# Altium project Level Switching Isolator.PrjPcb
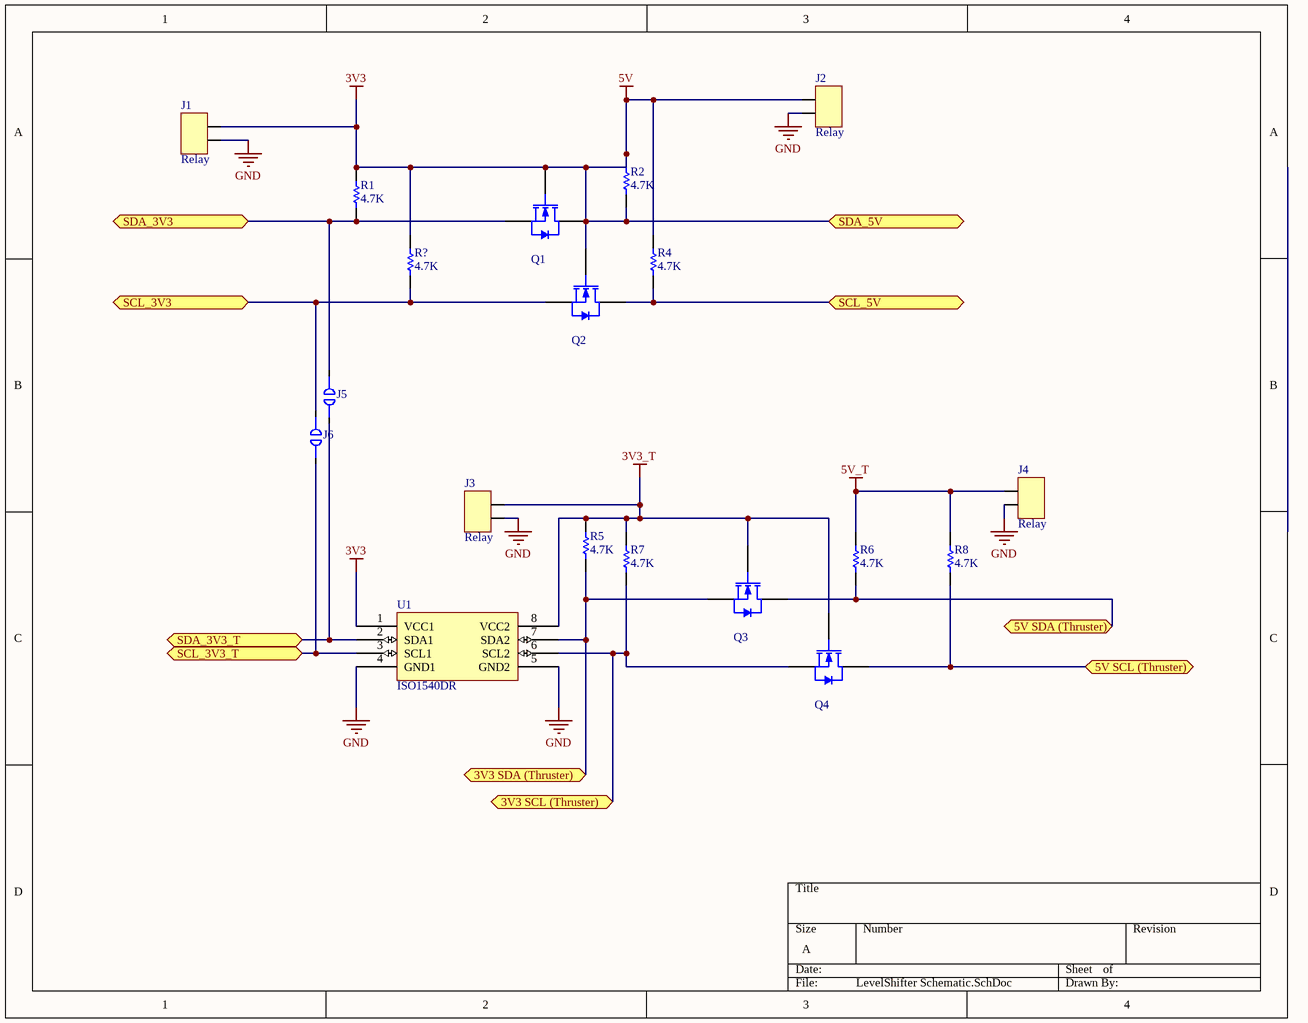
[diagram p0: LevelShifter Schematic.SchDoc]
1 sheet, 19 parts. Net scope: flat (ports and power ports of the same name join across sheets).

## Sheet LevelShifter Schematic.SchDoc
size A; SheetNumber: 1; SheetTotal: 1

### Parts
J1  Relay  [2PinHeader]
J2  Relay  [2PinHeader]
J3  Relay  [2PinHeader]
J4  Relay  [2PinHeader]
J5  Solder Jumper  [SolderJumper]  (value not drawn)
J6  Solder Jumper  [SolderJumper]  (value not drawn)
Q1  MOSFET N-CH  [ONSC-SOT-23-3-318-08_V]  (value not drawn)
Q2  MOSFET N-CH  [ONSC-SOT-23-3-318-08_V]  (value not drawn)
Q3  MOSFET N-CH  [ONSC-SOT-23-3-318-08_V]  (value not drawn)
Q4  MOSFET N-CH  [ONSC-SOT-23-3-318-08_V]  (value not drawn)
R1  4.7K  [RESC1609X55X30NL10T20]
R2  4.7K  [RESC1609X55X30NL10T20]
R4  4.7K  [RESC1609X55X30NL10T20]
R5  4.7K  [RESC1609X55X30NL10T20]
R6  4.7K  [RESC1609X55X30NL10T20]
R7  4.7K  [RESC1609X55X30NL10T20]
R8  4.7K  [RESC1609X55X30NL10T20]
R?  4.7K  [RESC1609X55X30NL10T20]
U1  ISO1540DR

### Ports
3V3 SCL (Thruster) (bidir), 3V3 SDA (Thruster) (bidir), 5V SCL (Thruster) (bidir), 5V SDA (Thruster) (bidir), SCL_3V3 (bidir), SCL_3V3_T (bidir), SCL_5V (bidir), SDA_3V3 (bidir), SDA_3V3_T (bidir), SDA_5V (bidir)

### Nets
3V3: J1.2 J2.1 Q1.1(G) Q1.3(D) Q2.1(G) R1.2 R2.1 R2.2 R4.2 R?.2 U1.1(VCC1) ; port SDA_5V  [also labelled 5V]
3V3_T: J3.2 Q3.1(G) Q4.1(G) R5.2 R7.2 U1.8(VCC2)
5V_T: J4.1 R6.2 R8.2
GND: J1.1 J2.2 J3.1 J4.2 U1.4(GND1) U1.5(GND2)
NetJ5_1: J5.1 U1.2(SDA1) ; port SDA_3V3_T
NetJ5_2: J5.2 Q1.2(S) R1.1 ; port SDA_3V3
NetJ6_1: J6.1 U1.3(SCL1) ; port SCL_3V3_T
NetJ6_2: J6.2 Q2.2(S) R?.1 ; port SCL_3V3
NetQ2_3: Q2.3(D) R4.1 ; port SCL_5V
NetQ3_2: Q3.2(S) R5.1 U1.7(SDA2) ; port 3V3 SDA (Thruster)
NetQ3_3: Q3.3(D) R6.1 ; port 5V SDA (Thruster)
NetQ4_2: Q4.2(S) R7.1 U1.6(SCL2) ; port 3V3 SCL (Thruster)
NetQ4_3: Q4.3(D) R8.1 ; port 5V SCL (Thruster)

### Library data of the parts
J1-J4 = 2PinHeader: Supplier 1: Digi-Key; Supplier Part Number 1: 3M9457-36-ND
J5 J6 = Solder Jumper: Simple Jumper
Q1-Q4 = BSS138LT1G: MOSFET N-CH 50V 200MA SOT-23; Manufacturer 1: ON Semiconductor; Rds On Max: 3.5R; Max Power Dissipation: 225mW; Input Capacitance: 50pF; Turn-Off Delay Time: 20ns; Gate to Source Voltage (Vgs): 20V; Number of Elements: 1; Element Configuration: Single; Threshold Voltage: 1.5V; Supplier 1: Digi-Key; Supplier Part Number 1: BSS138LT1GOSCT-ND; Manufacturer Part Number 1: BSS138LT1G; Stock 1: 952638; Pricing 1: 1=0.26000, 10=0.21100, 100=0.11210, 500=0.07376, 1000=0.05016 (USD); RoHS: Yes; Case/Package: SOT-23-3; Number of Pins: 3; Contact Plating: Tin,Matte; Min Operating Temperature: -55°C; Max Operating Temperature: 150°C; Packaging: Tape and Reel; Continuous Drain Current (ID): 200mA; Drain to Source Resistance: 3.5R; Package Quantity: 1; Drain to Source Breakdown Voltage: 50V; Power Dissipation: 225mW; Turn-On Delay Time: 20ns; Nominal Vgs: 1.5V; Voltage Rating (DC): 50V; Current Rating: 200mA; On-State Resistance: 3.5R; Length: 3.04mm; Height: 1.01mm; Width: 1.4mm; Radiation Hardening: No; Lead Free: Lead Free; REACH SVHC: No SVHC; Halogen Free: Halogen Free; ComponentLink1URL: https://datasheet.ciiva.com/22641/1596366-22641636.pdf?src-supplier=Element14; ComponentLink1Description: https://datasheet.ciiva.com/22641/1596366-22641636.pdf?src-supplier=Element14; ComponentLink2URL: https://datasheet.ciiva.com/936/bss138lt1-d-936801.pdf?src-supplier=Digi-Key; ComponentLink2Description: https://datasheet.ciiva.com/936/bss138lt1-d-936801.pdf?src-supplier=Digi-Key; ComponentLink3URL: https://datasheet.ciiva.com/936/bss138lt1-d-936802.pdf?src-supplier=Digi-Key; ComponentLink3Description: https://datasheet.ciiva.com/936/bss138lt1-d-936802.pdf?src-supplier=Digi-Key; ComponentLink4URL: https://datasheet.ciiva.com/936/bss138lt1-d-936803.pdf?src-supplier=Digi-Key; ComponentLink4Description: https://datasheet.ciiva.com/936/bss138lt1-d-936803.pdf?src-supplier=Digi-Key; ComponentLink5URL: https://datasheet.ciiva.com/14553/70099493-14553829.pdf?src-supplier=Allied+Electronics; ComponentLink5Description: https://datasheet.ciiva.com/14553/70099493-14553829.pdf?src-supplier=Allied+Electronics; ComponentLink6URL: https://datasheet.ciiva.com/1190/1596366-1190136.pdf?src-supplier=Element14; ComponentLink6Description: https://datasheet.ciiva.com/1190/1596366-1190136.pdf?src-supplier=Element14; ComponentLink7URL: https://datasheet.ciiva.com/1190/1596366-1190137.pdf?src-supplier=Element14; ComponentLink7Description: https://datasheet.ciiva.com/1190/1596366-1190137.pdf?src-supplier=Element14; ComponentLink8URL: https://datasheet.ciiva.com/15198/getdatasheetpartid-110266-15198908.pdf?src-supplier=Verical; ComponentLink8Description: https://datasheet.ciiva.com/15198/getdatasheetpartid-110266-15198908.pdf?src-supplier=Verical; ComponentLink9URL: https://datasheet.ciiva.com/8115/bss138lt1-d-8115358.pdf?src-supplier=Avnet; ComponentLink9Description: https://datasheet.ciiva.com/8115/bss138lt1-d-8115358.pdf?src-supplier=Avnet; ComponentLink10URL: https://datasheet.ciiva.com/8115/bss138lt1-d-8115295.pdf?src-supplier=Avnet; ComponentLink10Description: https://datasheet.ciiva.com/8115/bss138lt1-d-8115295.pdf?src-supplier=Avnet
R1 R2 R4-R8 R? = OX472KE: RES 4.7K  OHM 0.1% 1W 0603; Manufacturer 1: Vishay; Manufacturer Part Number 1: TNPW06032K20BYEN; Resistance: 2.2kR; Temperature Coefficient: 10ppm/°C; Power Rating: 100mW; Stock 1: 1000; Pricing 1: 1=0.88000, 10=0.76200, 100=0.53130 (USD); RoHS: Yes; Mount: Surface Mount; Case/Package: 0603; Contact Plating: Tin; Min Operating Temperature: -55°C; Max Operating Temperature: 125°C; Tolerance: 0.1%; Composition: Thin Film; Packaging: Tape and Reel; Military Standard: Not; Length: 1.6mm; Height: 0.45mm; Depth: 0.85mm; Radiation Hardening: No; ComponentLink1URL: https://datasheet.ciiva.com/11821/0900766b80d9a43d-11821758.pdf?src-supplier=RSComponents; ComponentLink1Description: https://datasheet.ciiva.com/11821/0900766b80d9a43d-11821758.pdf?src-supplier=RSComponents; ComponentLink2URL: https://datasheet.ciiva.com/17202/tnpw-e3-17202093.pdf?src-supplier=Avnet+Europe; ComponentLink2Description: https://datasheet.ciiva.com/17202/tnpw-e3-17202093.pdf?src-supplier=Avnet+Europe; Supplier 1: Digi-Key; Supplier Part Number 1: OX472KE-ND
U1 = ISO1540DR: TEXAS INSTRUMENTS - ISO1540DR - DIGITAL ISOLATOR, 2-CH, 1MBPS, SOIC-8; Number of Channels: 2; Min Supply Voltage: 3V; Max Supply Voltage: 5.5V; Nominal Supply Current: 3.6mA; Channel Type: Bidirectional; Propagation Delay: 70ns; Isolated Power: No; Pulse Width Distortion (PWD): 21ns; Working Voltage: 566V; Supplier 1: Digi-Key; Supplier Part Number 1: 296-34871-1-ND; Manufacturer: Texas Instruments; Manufacturer Part Number 1: ISO1540DR; RoHS: Yes; Category: Interface ICs; Stock 1: 11170; Pricing: 1=4.51000, 10=4.04600, 25=3.82520, 100=3.14500, 250=2.82200, 500=2.72000, 1000=2.26100 (USD); Mount: Surface Mount; Case/Package: SOIC; Number of Pins: 8; Min Operating Temperature: -40°C; Max Operating Temperature: 125°C; Data Rate: 1Mbps; Packaging: Tape and Reel; Package Quantity: 1; REACH SVHC: No SVHC; Lead Free: Lead Free; ComponentLink1URL: https://datasheet.ciiva.com/6579/iso1540-6579725.pdf?src-supplier=Digi-Key; ComponentLink1Description: https://datasheet.ciiva.com/6579/iso1540-6579725.pdf?src-supplier=Digi-Key; ComponentLink2URL: https://datasheet.ciiva.com/6579/iso1540-6579723.pdf?src-supplier=Digi-Key; ComponentLink2Description: https://datasheet.ciiva.com/6579/iso1540-6579723.pdf?src-supplier=Digi-Key; ComponentLink3URL: https://datasheet.ciiva.com/6579/iso1540-6579724.pdf?src-supplier=Digi-Key; ComponentLink3Description: https://datasheet.ciiva.com/6579/iso1540-6579724.pdf?src-supplier=Digi-Key; ComponentLink4URL: https://datasheet.ciiva.com/14196/iso1540-14196749.pdf?src-supplier=Avnet; ComponentLink4Description: https://datasheet.ciiva.com/14196/iso1540-14196749.pdf?src-supplier=Avnet